# EAGLE design CC2538-CP2102-Zigbee-V01-003 (EAGLE 9.5.1)
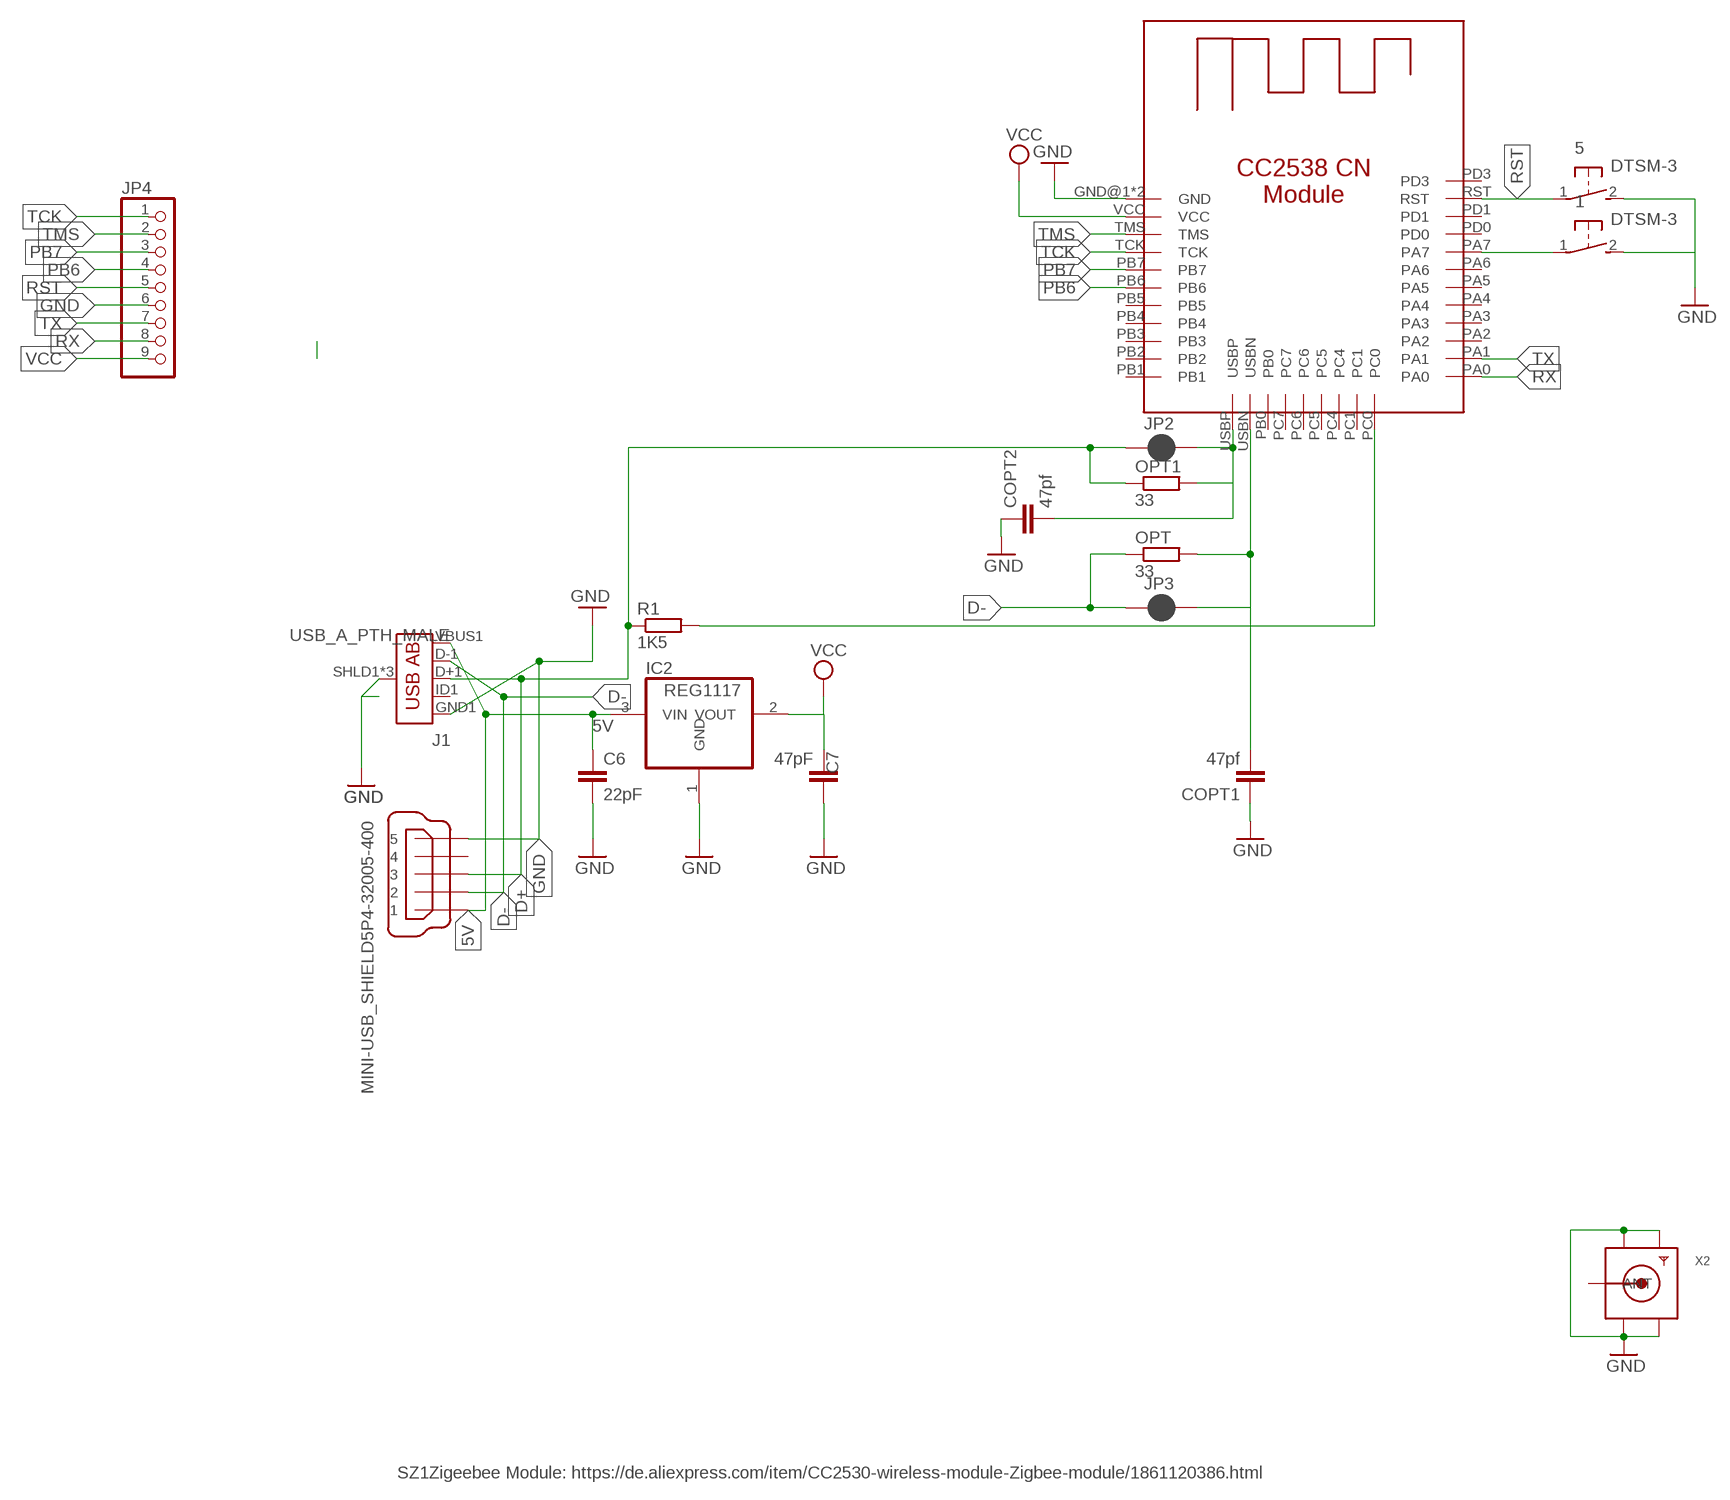
[diagram p0: schematic, sheet 1]

## Parts
1  DTSM-3  [DTSM-3]
5  DTSM-3  [DTSM-3]
C6  22pF  C-EUC0805  [C0805]
C7  47pF  C-EUC0805  [C0805]
COPT1  47pf  C-EUC0805  [C0805]
COPT2  47pf  C-EUC0805  [C0805]
IC2  REG1117  [SOT223]
J1  USB_A_PTH_MALE  USB_AB_SMT  [USB-AB-MICRO-SMD]
JP2  JUMPER-SMT_2_NC_PASTE_NO-SILK  [SMT-JUMPER_2_NC_PASTE_NO-SILK]
JP3  JUMPER-SMT_2_NC_PASTE_NO-SILK  [SMT-JUMPER_2_NC_PASTE_NO-SILK]
JP4  PINHD-1X09_2.54-SMD-90°  [1X09SMD/90]
OPT  33  R-EU_R0805W  [R0805W]
OPT1  33  R-EU_R0805W  [R0805W]
R1  1K5  R-EU_R0805W  [R0805W]
U$3  CC2538-CN  [CC2538-CN]
X1  MINI-USB_SHIELD5P4-32005-400  [32005-400]
X2  SMACONNECTOR_EDGE  [SMA_EDGELAUNCH]

## Nets
5V [PWR]: C6.1 IC2.3(VIN) J1.VBUS1(VBUS) X1.1
D+: J1.D+1(D+) JP2.1 OPT1.1 R1.1 X1.3
D-: J1.D-1(D-) JP3.1 OPT.1 X1.2
GND [PWR]: 1.2 5.2 C6.2 C7.1 COPT1.1 COPT2.1 IC2.1(GND) J1.GND1(GND) J1.SHLD1(SHIELD) J1.SHLD2(SHIELD) J1.SHLD3(SHIELD) JP4.6 U$3.GND@1(GND) U$3.GND@2(GND) X1.5 X2.GND@1(GND4) X2.GND@2(GND3) X2.GND@3(GND2) X2.GND@4(GND1)
N$3: 1.1 U$3.PA7
N$4: R1.2 U$3.PC0
N$5: COPT2.2 JP2.2 OPT1.2 U$3.USBP
N$6: COPT1.2 JP3.2 OPT.2 U$3.USBN
PB6: JP4.4 U$3.PB6
PB7: JP4.3 U$3.PB7
RST: 5.1 JP4.5 U$3.RST
RX: JP4.8 U$3.PA0
TCK: JP4.1 U$3.TCK
TMS: JP4.2 U$3.TMS
TX: JP4.7 U$3.PA1
VCC [PWR]: C7.2 IC2.2(VOUT) JP4.9 U$3.VCC
Unconnected: J1.ID1(USBID) U$3.PA2 U$3.PA3 U$3.PA4 U$3.PA5 U$3.PA6 U$3.PB0 U$3.PB1 U$3.PB2 U$3.PB3 U$3.PB4 U$3.PB5 U$3.PC1 U$3.PC4 U$3.PC5 U$3.PC6 U$3.PC7 U$3.PD0 U$3.PD1 U$3.PD3 X1.4 X1.M1(S1) X1.M2(S2) X1.M3(S3) X1.M4(S4) X2.P(ANT)

## Notes on the sheet
- SZ1Zigeebee Module: https://de.aliexpress.com/item/CC2530-wireless-module-Zigbee-module/1861120386.html

## Library data of the parts
1 5 = mechanics:DTSM-3: Diptronics SMD button 6x3.5 mm
C6 C7 COPT1 COPT2 = rcl:C-EU: CAPACITOR, European symbol; SPICEPREFIX: C
IC2 = burr-brown:REG1117: 800mA and 1A Low Dropout (LDO) Positive Regulator 1.8V, 2.5V, 2.85V, 3.3V, 5V, and Adj; MPN: REG1117; OC_FARNELL: 1097566; OC_NEWARK: 14P6981
J1 = SparkFun-Connectors:USB_AB: USB Type AB Micro Connector OTG-compatible. 5 pins, 3 shield pins SparkFun Products: IOIO-OTG <https://www.sparkfun.com/products/13613> SparkFun SAMD21 Mini Breakout <https://www.sparkfun.com/products/13664>; PROD_ID: CONN-11794
JP2 JP3 = SparkFun-Jumpers:JUMPER-SMT_2_NC_PASTE: Normally closed solder jumper This jumper has an aperture in the stencil to allow solder paste to bridge the split in the wire so it's normally closed (NC). Wick off the solder to open the connection. Reapply solder to reclose the connection.
JP4 = pinhead-2:PINHD-1X09: PIN HEADER
OPT OPT1 R1 = rcl:R-EU_: RESISTOR, European symbol; SPICEPREFIX: R
U$3 = CC2538-CN:CC2538-CN: CC2538 + CC2592 typical Chinese Module black/green Credits 3D Model, take from uzsito's KiCad Component: https://github.com/uzsito/CC2538-CC2592-kicad-component
X1 = con-cypressindustries:MINI-USB_SHIELD5P4-: MINI USB-B R/A W/O POST 5 pol. Source: www.cypressindustries.com; OC_FARNELL: unknown; OC_NEWARK: unknown
X2 = adafruit:SMACONNECTOR: SMA Connector 90° DIP SMA Connector, 50 Ohm (4UConnector: 07259)

## Net classes
0 default: width 0.305 mm, drill 0.102 mm, clearance 0.102 mm
1 PWR: width 0.305 mm, drill 0.102 mm, clearance 0.102 mm to class 0, clearance 0.102 mm

## Board
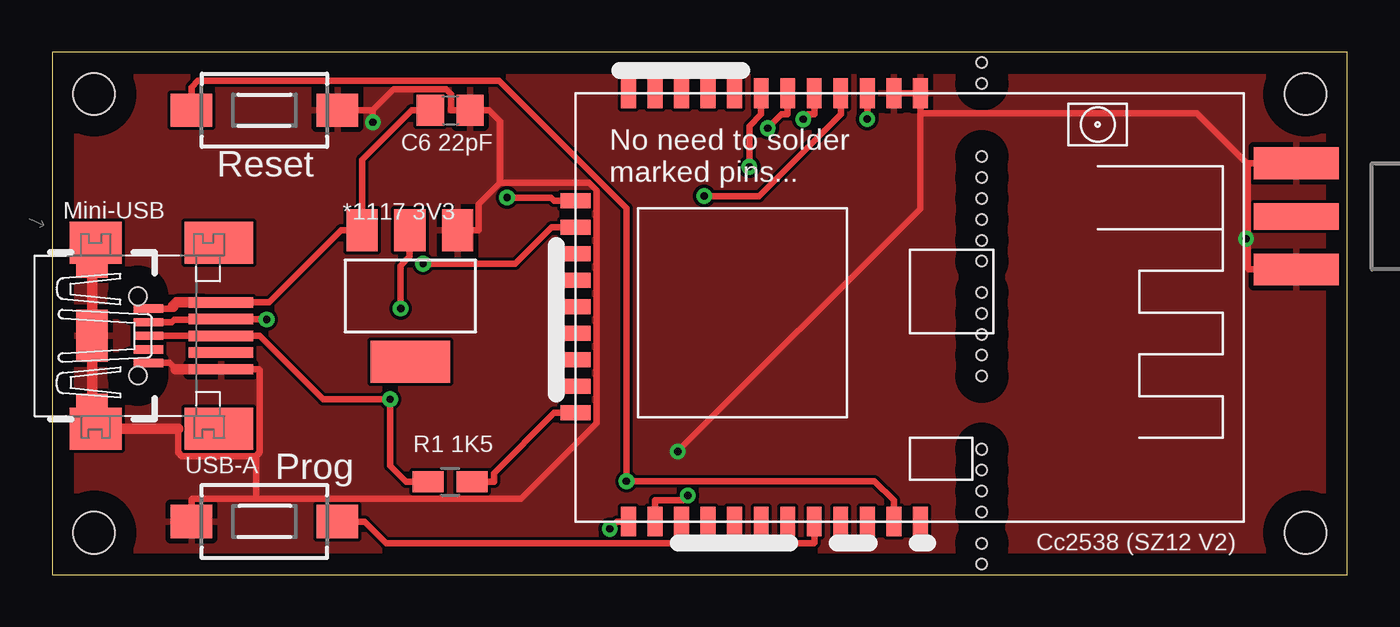
[diagram p1: board, top side]
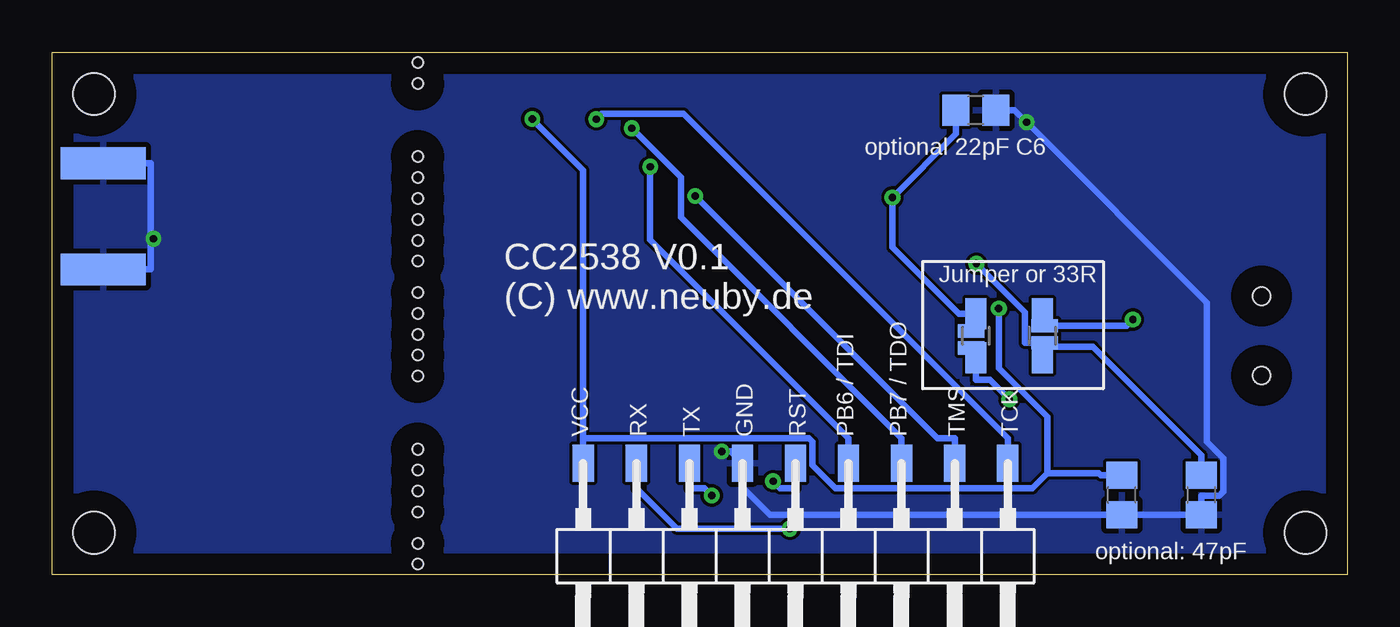
[diagram p2: board, bottom side, seen from below]

Size 62 x 25 mm. Coordinates in mm from the lower left corner, seen from the top.
Outline: 0,0 62,0 62,25 0,25 0,0
Copper layers (1*16): Top 0.035mm / dielectric 1.5mm / Bottom 0.035mm
Design rules "default": minimum track width 6mil, minimum drill 0.35mm, track to track 6mil, track to pad 6mil, pad to pad 6mil, via to via 6mil, smd to smd 6mil, copper to edge 40mil, drill to drill 6mil, minimum pad ring 10mil, minimum via ring 8mil, stop-mask expansion 4mil, vias tented up to drill 0mil, thermal gap 10mil
Holes 0.5 mm at 44.5,24.5 44.5,23.5 44.5,20 44.5,19 44.5,18 44.5,17 44.5,16 44.5,15 44.5,13.5 44.5,12.5 44.5,11.5 44.5,10.5 44.5,9.5 44.5,6 44.5,5 44.5,4 44.5,3 44.5,1.5 44.5,0.5
Holes 2 mm at 2,23 2,2 60,2 60,23

### Footprints (pad centres in the part's own frame; a part is rotated, then mirrored left to right if it is on the bottom)
DTSM-3 = smd 2 x 1.6: 1 -3.494,0; 2 3.494,0
C0805 = smd 1.3 x 1.5: 1 -0.95,0; 2 0.95,0
SOT223 = smd 1.499 x 2.007: 1 -2.261,-3.15; 2 0.025,-3.15; 3 2.311,-3.15 | smd 3.81 x 2.007: 4 0,3.15
USB-AB-MICRO-SMD = smd 1.4 x 0.4: D+1 2.7,0; D-1 2.7,0.65; GND1 2.7,-1.3; ID1 2.7,-0.65; VBUS1 2.7,1.3 | smd 1.5 x 1.8: SHLD1 0,-3.68; SHLD2 0,3.68 | smd 1.5 x 2.5: SHLD3 0,0 | hole 0.85: 2.2,1.9; 2.2,-1.9
SMT-JUMPER_2_NC_PASTE_NO-SILK = smd 0.635 x 1.27: 1 -0.406,0; 2 0.406,0
1X09SMD/90 = smd 1.016 x 1.778: 1 -1.27,-5.08; 2 1.27,-5.08; 3 3.81,-5.08; 4 6.35,-5.08; 5 8.89,-5.08; 6 11.43,-5.08; 7 13.97,-5.08; 8 16.51,-5.08; 9 19.05,-5.08
R0805W = smd 1.5 x 1: 1 -1.052,0; 2 1.052,0
CC2538-CN = smd 0.711 x 1.422: GND@1 16.51,20.5; GND@2 15.24,20.5; PA0 2.54,0; PA1 3.81,0; PA2 5.08,0; PA3 6.35,0; PA4 7.62,0; PA5 8.89,0; PA6 10.16,0; PA7 11.43,0; PB1 2.54,20.5; PB2 3.81,20.5; PB3 5.08,20.5; PB4 6.35,20.5; PB5 7.62,20.5; PB6 8.89,20.5; PB7 10.16,20.5; PD0 12.7,0; PD1 13.97,0; PD3 16.51,0; RST 15.24,0; TCK 11.43,20.5; TMS 12.7,20.5; VCC 13.97,20.5 | smd 1.422 x 0.711: PB0 0,12.82; PC0 0,5.2; PC1 0,6.47; PC4 0,7.74; PC5 0,9.01; PC6 0,10.28; PC7 0,11.55; USBN 0,14.09; USBP 0,15.36
32005-400 = smd 3.1 x 0.5: 1 3,1.6; 2 3,0.8; 3 3,0; 4 3,-0.8; 5 3,-1.6 | smd 2.5 x 2: M1 -3,-4.45; M2 -3,4.45 | smd 3.3 x 2: M3 2.9,4.45; M4 2.9,-4.45
SMA_EDGELAUNCH = smd 4.064 x 1.524: GND@1 2.032,-2.54; GND@2 2.032,2.54 | smd 4.064 x 1.524 bottom: GND@3 2.032,2.54; GND@4 2.032,-2.54 | smd 4.064 x 1.27: P 2.032,0

### Placement (x,y rotation side)
1  10.16,2.54 180 top
5  10.16,22.23 0 top
C6  19.05,22.23 0 top
C7  10.79,3.81 90 bottom
COPT1  6.99,3.81 90 bottom
COPT2  17.78,22.23 180 bottom
IC2  17.14,13.34 180 top
J1  1.91,11.43 0 top
JP2  18,11.25 90 bottom
JP3  14.49,11.51 270 bottom
JP4  17.53,0.25 180 bottom
OPT  14.61,11.43 270 bottom
OPT1  17.78,11.43 90 bottom
R1  19.05,4.45 0 top
U$3  25.05,2.54 0 top
X1  5.08,11.43 0 top
X2  61.59,17.14 180 top

### Tracks (layer width: path | path; a pad name or v marks a point on that pad's centre or on a via)
5V
  Top 0.305: 7.3,13.03 X1.1 10.38,13.03 13.83,16.48 IC2.3 14.83,19.86 17.2,22.23 C6.1 | J1.VBUS1 5.65,12.73 5.75,12.83
  Top 0.406: 5.75,12.83 | 5.75,12.83 5.8,12.83
  Top 0.508: 7.3,13.03 5.95,13.03 5.8,12.88 5.8,12.83
D+  (via drill 0.35 pad 0.76)
  Top 0.305: R1.1 16.94,4.45 16.18,5.21 v16.18,8.39 12.97,8.39 9.94,11.43 X1.3 J1.D+1
  Bottom 0.305: v16.18,8.39 17.11,9.32 17.78,9.32 OPT1.1 17.78,10.43 JP2.1
D-  (via drill 0.35 pad 0.76)
  Top 0.305: 8.08,12.21 v10.27,12.21 | J1.D-1 5.7,12.08 | 5.7,12.08 | 5.7,12.08 5.73,12.08 5.84,12.19 8.06,12.19 8.08,12.21 | 8.08,12.21 X1.2
  Bottom 0.305: v10.27,12.21 10.56,11.91 13.55,11.91 JP3.1 14.49,12.37 OPT.1
GND  (via drill 0.35 pad 0.76)
  Top 0.305: 41.56,22.07 41.56,17.51 v29.95,5.9 | 41.56,22.07 U$3.GND@1 U$3.GND@2 | 41.56,22.07 54.79,22.07 57.23,19.63 | v57.16,16.07 57.23,16.07 | 57.23,16.07 57.23,19.63 | 57.23,16.07 57.23,14.66 57.28,14.61 X2.GND@2 | 21.43,18.75 20.41,17.73 20.41,16.48 IC2.1 | 9.76,3.64 22.45,3.64 26.07,7.26 26.07,18.39 25.7,18.75 21.43,18.75 | 21.43,18.75 21.43,21.69 20.9,22.23 C6.2 19.1,22.23 19.1,22.99 18.86,23.23 16.35,23.23 15.35,22.23 | 9.76,3.64 6.71,3.64 6.67,3.59 1.2 | 9.76,5.67 9.76,3.64 | 9.76,5.67 6.2,5.67 6.03,5.85 6.03,6.99 | 9.76,5.67 9.94,5.85 9.94,9.78 9.88,9.83 X1.5 7.94,9.83 | 5.92,9.83 5.62,10.13 J1.GND1 | 5.2 15.35,22.23 | v15.35,21.65 15.35,22.23 | X2.GND@1 57.28,19.68 57.23,19.63
  Top 0.508: J1.SHLD2 J1.SHLD3 J1.SHLD1 2.67,6.99 6.03,6.99 | 7.94,9.83 5.92,9.83
  Bottom 0.305: v29.95,5.9 29.52,5.9 JP4.6 28.96,4.19 27.64,2.88 11.81,2.88 11.8,2.86 C7.1 COPT1.1 6.99,3.76 6.14,3.76 5.93,3.97 5.93,5.58 6.71,6.36 6.71,13.01 v15.35,21.65 15.93,22.23 COPT2.1 | 57.28,16.07 57.28,14.61 X2.GND@2 | 57.28,16.07 57.28,19.68 X2.GND@1 | 57.28,16.07 v57.16,16.07
  pour Bottom: 0.64,24.13 61.59,24.13 61.59,0.64 0.64,0.64
  pour Top: 0.64,24.13 61.59,24.13 61.59,0.64 0.64,0.64
N$3
  Top 0.305: 1.1 14.96,2.54 15.99,1.51 36.47,1.51 36.48,1.52 U$3.PA7
N$4
  Top 0.305: R1.2 21.16,4.45 21.16,4.86 24.03,7.74 U$3.PC0
N$5  (via drill 0.35 pad 0.76)
  Top 0.305: v21.77,18.05 23.89,18.05 24.03,17.9 U$3.USBP
  Bottom 0.305: COPT2.2 18.73,21.09 v21.77,18.05 21.77,15.67 18.59,12.48 OPT1.2 17.98,12.28 18,12.28 JP2.2
N$6  (via drill 0.35 pad 0.76)
  Top 0.305: U$3.USBN 23.89,16.63 22.15,14.88 v17.75,14.88
  Bottom 0.305: v17.75,14.88 15.43,12.56 15.43,11.1 JP3.2 14.49,10.9 | COPT1.2 6.99,5.71 12.17,10.9 14.49,10.9 | 14.49,10.9 14.49,10.48 14.5,10.48 OPT.2
PB6  (via drill 0.35 pad 0.76)
  Top 0.305: U$3.PB6 33.94,22.02 33.37,21.45 v33.37,19.52
  Bottom 0.305: JP4.4 23.88,6.53 33.37,16.02 v33.37,19.52
PB7  (via drill 0.35 pad 0.76)
  Top 0.305: U$3.PB7 35.21,22.02 34.91,22.02 v34.25,21.36
  Bottom 0.305: JP4.3 21.34,6.53 31.9,17.09 31.9,19.01 v34.25,21.36
RST  (via drill 0.35 pad 0.76)
  Top 0.305: 5.1 6.67,23.33 6.97,23.64 21.39,23.64 27.49,17.54 v27.49,4.47 39.37,4.47 40.29,3.56 U$3.RST
  Bottom 0.305: JP4.5 26.42,4.14 27.16,4.14 v27.49,4.47
RX  (via drill 0.35 pad 0.76)
  Top 0.305: U$3.PA0 27.04,2.54 v26.69,2.19
  Bottom 0.305: v26.69,2.19 32.09,2.19 34.04,4.14 JP4.8
TCK  (via drill 0.35 pad 0.76)
  Top 0.305: U$3.TCK 36.48,22.02 36.18,22.02 v35.95,21.79
  Bottom 0.305: JP4.1 16.26,6.53 31.77,22.05 35.7,22.05 v35.95,21.79
TMS  (via drill 0.35 pad 0.76)
  Top 0.305: U$3.TMS 37.75,22.02 33.85,18.12 v31.21,18.12
  Bottom 0.305: JP4.2 18.8,6.53 19.62,6.53 v31.21,18.12
TX  (via drill 0.35 pad 0.76)
  Top 0.305: v30.43,3.79 30.19,3.56 28.86,3.56 U$3.PA1
  Bottom 0.305: v30.43,3.79 30.78,4.14 31.5,4.14 JP4.7
VCC  (via drill 0.35 pad 0.76)
  Top 0.305: IC2.2 17.12,15.23 16.68,14.79 v16.68,12.73 | U$3.VCC v39.02,21.8
  Bottom 0.305: 14.35,4.86 14.35,7.55 16.68,9.89 v16.68,12.73 | 14.35,4.86 11.9,4.86 11.8,4.76 C7.2 | 36.58,6.53 25.78,6.53 25.6,6.35 25.6,5.23 24.52,4.14 15.07,4.14 14.35,4.86 | 36.58,6.53 36.58,19.36 v39.02,21.8 | JP4.9 36.58,6.53

### Text on the board
tNames: C6 22pF | Reset | No need to solder / marked pins... | *1117 3V3 | Mini-USB | R1 1K5 | USB-A | Prog | Cc2538 (SZ12 V2)
bNames: optional 22pF C6 | Jumper or 33R | CC2538 V0.1 / (C) www.neuby.de | TCK | TMS | PB7 / TDO | PB6 / TDI | RST | GND | TX | RX | VCC | optional: 47pF